# EAGLE schematic ArtNet_Node (EAGLE 6.5.0)
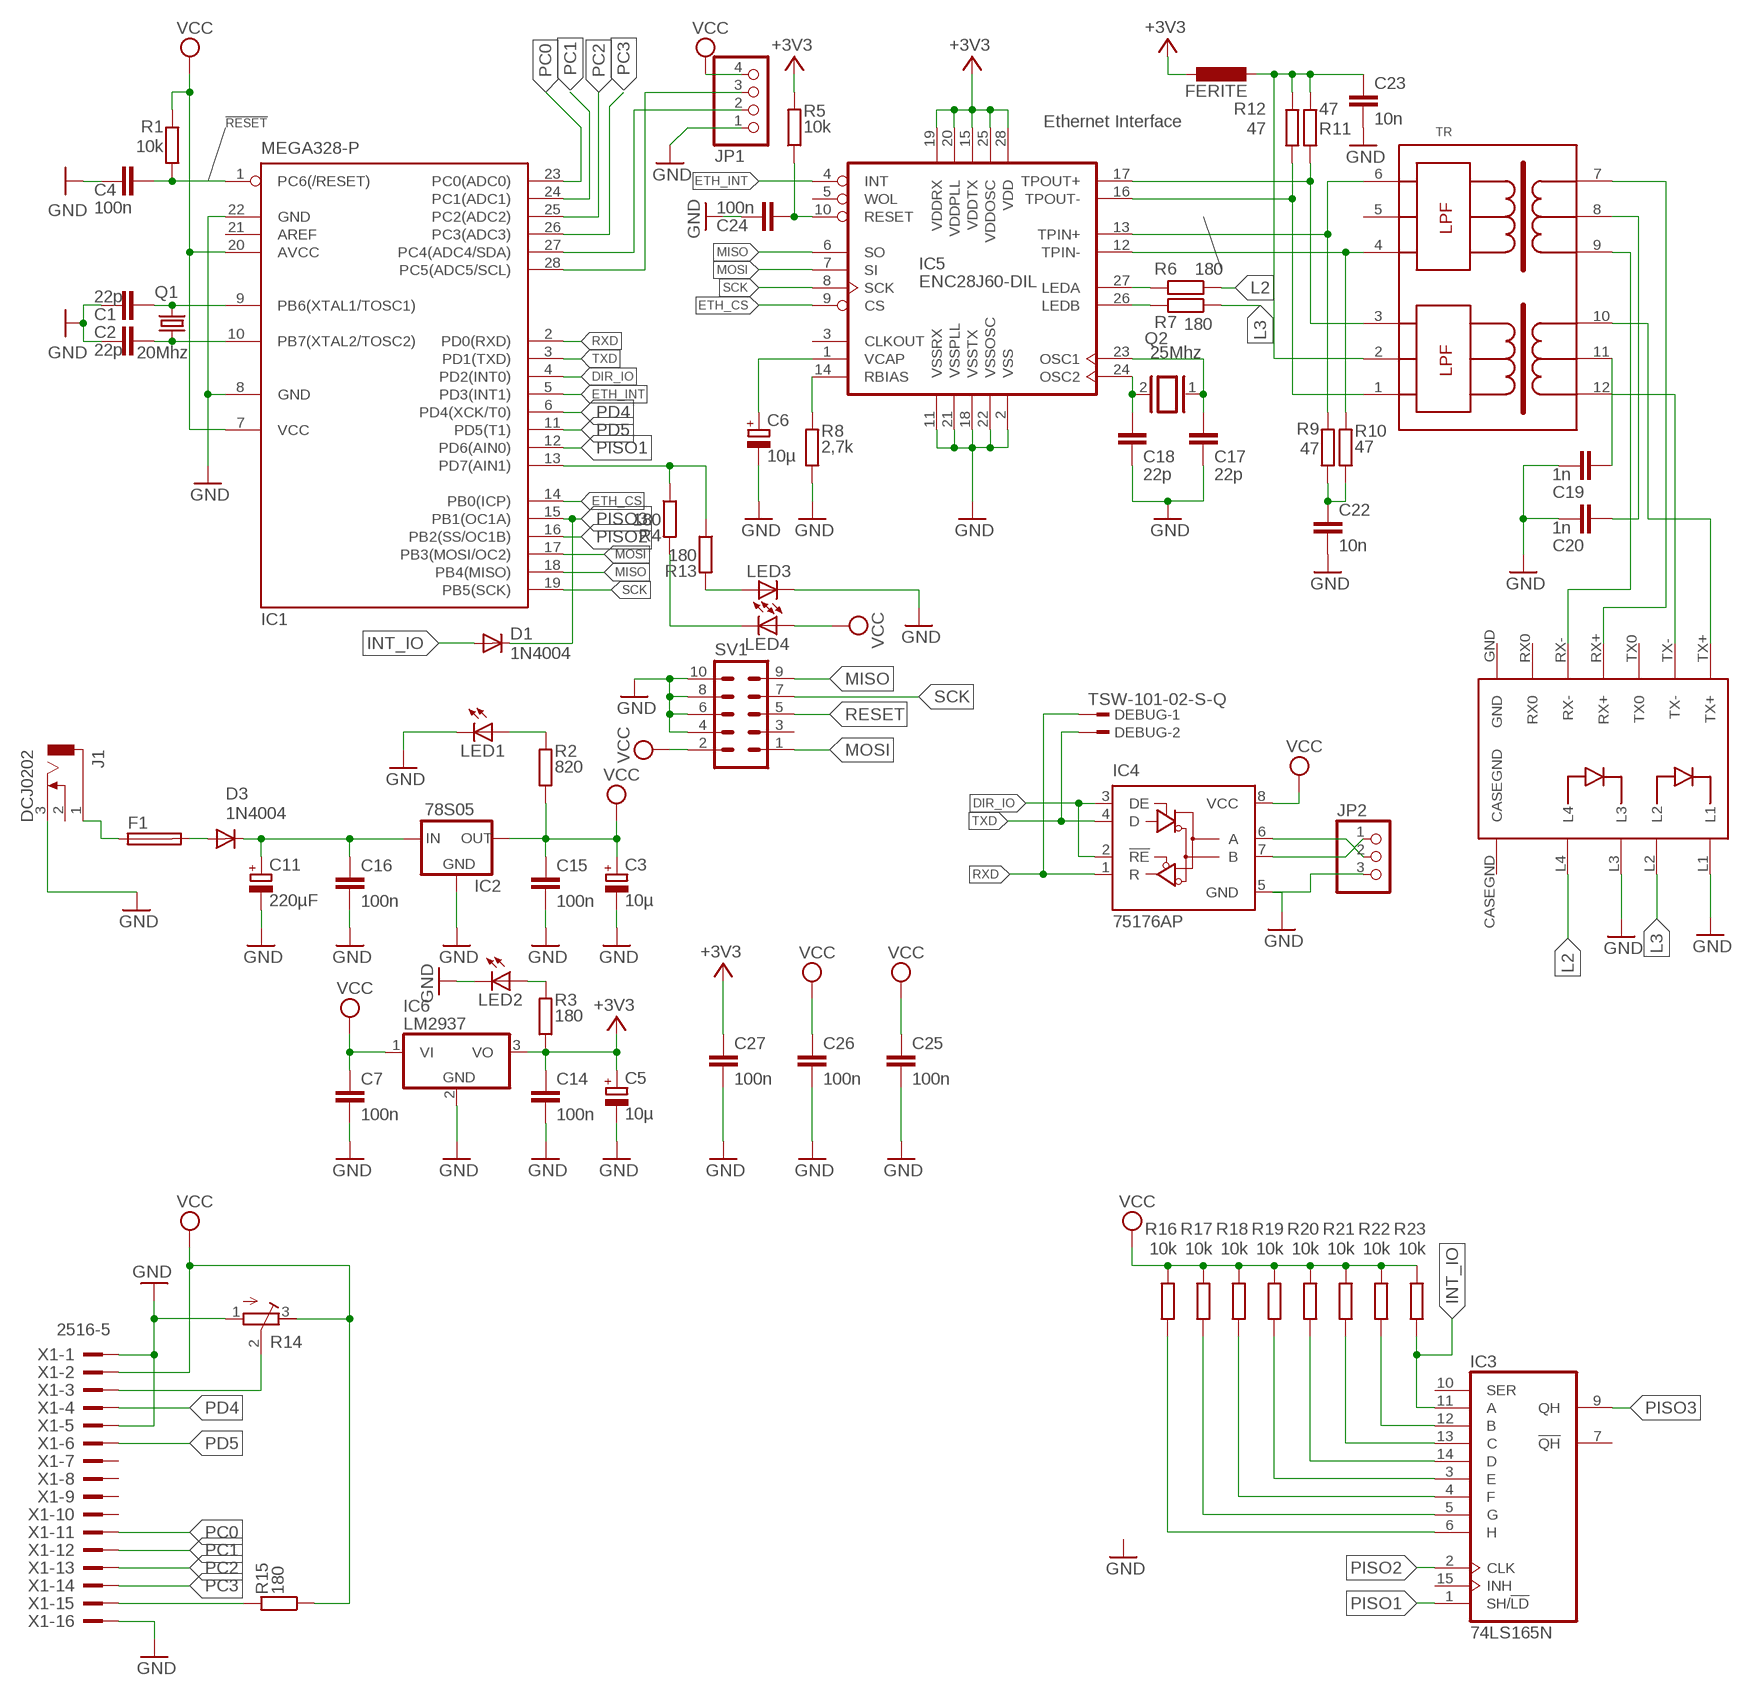
[diagram p0: schematic, sheet 1]

## Parts
C1  22p  C-EU025-024X044  [C025-024X044]
C2  22p  C-EU025-024X044  [C025-024X044]
C3  10µ  CPOL-EUE2-5  [E2-5]
C4  100n  C-EU025-024X044  [C025-024X044]
C5  10µ  CPOL-EUE2-5  [E2-5]
C6  10µ  CPOL-EUE2-5  [E2-5]
C7  100n  C-EU025-024X044  [C025-024X044]
C11  220µF  CPOL-EUE3.5-8  [E3,5-8]
C14  100n  C-EU025-024X044  [C025-024X044]
C15  100n  C-EU050-024X044  [C050-024X044]
C16  100n  C-EU050-024X044  [C050-024X044]
C17  22p  C-EU025-024X044  [C025-024X044]
C18  22p  C-EU025-024X044  [C025-024X044]
C19  1n  C-EU025-024X044  [C025-024X044]
C20  1n  C-EU025-024X044  [C025-024X044]
C22  10n  C-EU025-025X050  [C025-025X050]
C23  10n  C-EU025-025X050  [C025-025X050]
C24  100n  C-EU025-024X044  [C025-024X044]
C25  100n  C-EU025-025X050  [C025-025X050]
C26  100n  C-EU025-025X050  [C025-025X050]
C27  100n  C-EU025-025X050  [C025-025X050]
D1  1N4004  [DO41-10]
D3  1N4004  [DO41-10]
DEBUG  TSW-101-02-S-Q  [TSW-101-02-S-Q]
F1  PICOFUSE  [PICOFUSE]
FERITE  L-EU0204/5  [0204/5]
IC1  MEGA328-P  MEGA8-P  [DIL28-3]
IC2  78S05  78XXL  [78XXL]
IC3  74LS165N  [DIL16]
IC4  75176AP  [DIL08]
IC5  ENC28J60-DIL  [DIL28-3]
IC6  LM2937  [TO263-3]
J1  DCJ0202  [DCJ0202]
JP1  PINHD-1X4  [1X04]
JP2  PINHD-1X3  [1X03]
LED1  LED5MM  [LED5MM]
LED2  LED5MM  [LED5MM]
LED3  LED5MM  [LED5MM]
LED4  LED5MM  [LED5MM]
Q1  20Mhz  CRYTALHC49U-V  [HC49U-V]
Q2  25Mhz  XTAL/S  [QS]
R1  10k  R-EU_0207/10  [0207/10]
R2  820  R-EU_0207/10  [0207/10]
R3  180  R-EU_0207/10  [0207/10]
R4  180  R-EU_0207/10  [0207/10]
R5  10k  R-EU_0207/10  [0207/10]
R6  180  R-EU_0207/10  [0207/10]
R7  180  R-EU_0207/10  [0207/10]
R8  2,7k  R-EU_0207/10  [0207/10]
R9  47  R-EU_0207/10  [0207/10]
R10  47  R-EU_0207/10  [0207/10]
R11  47  R-EU_0207/10  [0207/10]
R12  47  R-EU_0207/10  [0207/10]
R13  180  R-EU_0207/10  [0207/10]
R14  R-TRIMM74X  [RTRIM74X]
R15  180  R-EU_0207/10  [0207/10]
R16  10k  R-EU_0207/10  [0207/10]
R17  10k  R-EU_0207/10  [0207/10]
R18  10k  R-EU_0207/10  [0207/10]
R19  10k  R-EU_0207/10  [0207/10]
R20  10k  R-EU_0207/10  [0207/10]
R21  10k  R-EU_0207/10  [0207/10]
R22  10k  R-EU_0207/10  [0207/10]
R23  10k  R-EU_0207/10  [0207/10]
SV1  ML10L  [ML10L]
TR  20F001  [DIL16/12]
U$1  1XRJ45_MM_JACK  [1XRJ45_MM_JACK]
X1  2516-5  [PAK100/2500-5-16]

## Nets
!RESET: C4.2 IC1.1(PC6(/RESET)) R1.1
+3V3: C5.+ C14.1 C27.1 FERITE.1 IC5.15(VDDTX) IC5.19(VDDRX) IC5.20(VDDPLL) IC5.25(VDDOSC) IC5.28(VDD) IC6.3(VO) R3.1 R5.2
DIR_IO: IC1.4(PD2(INT0)) IC4.2(!RE) IC4.3(DE)
ETH_CS: IC1.14(PB0(ICP)) IC5.9(CS)
ETH_INT: IC1.5(PD3(INT1)) IC5.4(INT)
GND: C1.1 C2.1 C3.- C4.1 C5.- C6.- C7.2 C11.- C14.2 C15.2 C16.2 C17.1 C18.1 C19.2 C20.2 C22.2 C23.2 C24.1 C25.1 C26.2 C27.2 IC1.8(GND) IC1.22(GND) IC2.GND IC4.5(GND) IC5.2(VSS) IC5.11(VSSRX) IC5.18(VSSTX) IC5.21(VSSPLL) IC5.22(VSSOSC) IC6.2(GND) J1.3 JP1.1 JP2.3 LED1.K(C) LED2.K(C) LED3.K(C) R8.1 R14.1(E) SV1.4 SV1.6 SV1.8 SV1.10 U$1.L1 U$1.L3 X1.1 X1.5 X1.16
INT_IO: D1.A IC3.11(A) R23.2
L2: R6.1 U$1.L4
L3: R7.1 U$1.L2
MISO: IC1.18(PB4(MISO)) IC5.6(SO) SV1.9
MOSI: IC1.17(PB3(MOSI/OC2)) IC5.7(SI) SV1.1
N$1: C2.2 IC1.10(PB7(XTAL2/TOSC2)) Q1.1
N$2: C1.2 IC1.9(PB6(XTAL1/TOSC1)) Q1.2
N$3: TR.9 U$1.RX-
N$6: D3.A F1.2
N$7: TR.12 U$1.TX-
N$8: TR.10 U$1.TX+
N$9: IC4.7(B) JP2.1
N$10: F1.1 J1.1
N$11: IC5.27(LEDA) R6.2
N$12: IC1.27(PC4(ADC4/SDA)) JP1.2
N$13: IC4.6(A) JP2.2
N$14: IC5.26(LEDB) R7.2
N$15: TR.7 U$1.RX+
N$16: C20.1 TR.8
N$17: C19.1 TR.11
N$20: C18.2 IC5.24(OSC2) Q2.2
N$21: C17.2 IC5.23(OSC1) Q2.1
N$22: IC5.12(TPIN-) R10.2 TR.4
N$23: IC5.13(TPIN+) R9.2 TR.6
N$24: IC5.16(TPOUT-) R12.2 TR.1
N$25: IC5.17(TPOUT+) R11.2 TR.3
N$26: IC5.14(RBIAS) R8.2
N$27: C6.+ IC5.1(VCAP)
N$28: IC1.28(PC5(ADC5/SCL)) JP1.3
N$29: C22.1 R9.1 R10.1
N$30: C24.2 IC5.10(RESET) R5.1
N$31: LED1.A R2.2
N$32: LED2.A R3.2
N$33: IC1.13(PD7(AIN1)) R4.1 R13.1
N$34: R14.2(S) X1.3
N$35: LED3.A R13.2
N$36: LED4.K(C) R4.2
N$38: R15.2 X1.15
N$39: IC3.12(B) R22.2
N$40: IC3.13(C) R21.2
N$41: IC3.14(D) R20.2
N$42: IC3.3(E) R19.2
N$43: IC3.4(F) R18.2
N$44: IC3.5(G) R17.2
N$45: IC3.6(H) R16.2
N$46: LED4.A ; supply symbol labelled VCC
N$248: C23.1 FERITE.2 R11.1 R12.1 TR.2
N$250: C11.+ C16.1 D3.C IC2.IN
PC0: IC1.23(PC0(ADC0)) X1.11
PC1: IC1.24(PC1(ADC1)) X1.12
PC2: IC1.25(PC2(ADC2)) X1.13
PC3: IC1.26(PC3(ADC3)) X1.14
PD4: IC1.6(PD4(XCK/T0)) X1.4
PD5: IC1.11(PD5(T1)) X1.6
PISO1: IC1.12(PD6(AIN0)) IC3.1(SH/!LD)
PISO2: IC1.16(PB2(SS/OC1B)) IC3.2(CLK)
PISO3: D1.C IC1.15(PB1(OC1A)) IC3.9(QH)
RESET: SV1.5
RXD: DEBUG.1 IC1.2(PD0(RXD)) IC4.1(R)
SCK: IC1.19(PB5(SCK)) IC5.8(SCK) SV1.7
TXD: DEBUG.2 IC1.3(PD1(TXD)) IC4.4(D)
VCC: C3.+ C7.1 C15.1 C25.2 C26.1 IC1.7(VCC) IC1.20(AVCC) IC2.OUT IC4.8(VCC) IC6.1(VI) JP1.4 R1.2 R2.1 R14.3(A) R15.1 R16.1 R17.1 R18.1 R19.1 R20.1 R21.1 R22.1 R23.1 SV1.2 X1.2
Unconnected: IC1.21(AREF) IC3.7(!QH) IC3.10(SER) IC3.15(INH) IC5.3(CLKOUT) IC5.5(WOL) J1.2 SV1.3 TR.5 U$1.CASEGND U$1.GND U$1.RX0 U$1.TX0 X1.7 X1.8 X1.9 X1.10

## Notes on the sheet
- Ethernet Interface

## Power pins joined to a net without a drawn wire
GND: IC3.8(GND)
VCC: IC3.16(VCC)

## Library data of the parts
C1 C2 C4 C7 C14-C20 C22-C27 = rcl:C-EU: CAPACITOR, European symbol
C3 C5 C6 C11 = rcl:CPOL-EU: POLARIZED CAPACITOR, European symbol
D1 D3 = diode:1N4004: DIODE general purpose rectifier, 1 A
DEBUG = con-samtec:TSW-101-02-S-Q: THROUGH-HOLE .025" SQ POST HEADER Source: Samtec TSW.pdf; OC_FARNELL: unknown; OC_NEWARK: unknown
F1 = fuse:PICOFUSE: PICOFUSE 19275, Wickmann
FERITE = rcl:L-EU: INDUCTOR, European symbol
IC1 = atmel:MEGA8-P: MICROCONTROLLER 8 Kbytes FLASH, 1 kbytes SRAM, 512 bytes EEPROM, USART, 4-channel 10 bit ADC, 2-channel 8 bit ADC Pin compatible with Atmega48, ATMega88, ATMega168 Source: avr.lbr; OC_FARNELL: unknown; OC_NEWARK: unknown
IC2 = v-reg:78XXL: VOLTAGE REGULATOR
IC3 = 74xx-us:74*165: 8-bit parallel load SHIFT REGISTER
IC4 = 751xx:75176A: DIFFERENTIAL BUS TRANSCEIVER Source: http://focus.ti.com/lit/ds/symlink/sn75176a.pdf
IC5 = enc28j60centered:ENC28J60-*: Microchip 10Mbit Ethernet controller with SPI interface Improved SOIC28 layout (pads in 0.01 raster, pin1 slightly smaller). Pin 6 (SO) changed from Out (paralleling several Outs gives an error) to OC. Author: Profi from mikrocontroller.net - forum Date: 2006.0827
IC6 = linear:LM2937: LM2937-2.5, LM2937-3.3 400mA and 500mA Voltage Regulators Source: http://cache.national.com/ds/LM/LM2937-2.5.pdf
J1 = con-jack:DCJ0202: DC POWER JACK Source: DCJ0202.pdf; OC_FARNELL: unknown; OC_NEWARK: unknown
JP1 = pinhead:PINHD-1X4: PIN HEADER
JP2 = pinhead:PINHD-1X3: PIN HEADER
LED1-LED4 = led:LED: LED OSRAM: - CHIPLED LG R971, LG N971, LY N971, LG Q971, LY Q971, LO R971, LY R971 LH N974, LH R974 LS Q976, LO Q976, LY Q976 LO Q996 - Hyper CHIPLED LW Q18S LB Q993, LB Q99A, LB R99A - SideLED LS A670, LO A670, LY A670, LG A670, LP A670 LB A673, LV A673, LT A673, LW A673 LH A674 LY A675 LS A676, LA A676, LO A676, LY A676, LW A676 LS A679, LY A679, LG A679 - Hyper Micro SIDELED® LS Y876, LA Y876, LO Y876, LY Y876 LT Y87S - SmartLED LW L88C, LW L88S LB L89C, LB L89S, LG L890 LS L89K, LO L89K, LY L89K LS L896, LA L896, LO L896, LY L896 - TOPLED LS T670, LO T670, LY T670, LG T670, LP T670 LSG T670, LSP T670, LSY T670, LOP T670, LYG T670 LG T671, LOG T671, LSG T671 LB T673, LV T673, LT T673, LW T673 LH T674 LS T676, LA T676, LO T676, LY T676, LB T676, LH T676, LSB T676, LW T676 LB T67C, LV T67C, LT T67C, LS T67K, LO T67K, LY T67K, LW E67C LS E67B, LA E67B, LO E67B, LY E67B, LB E67C, LV E67C, LT E67C LW T67C LS T679, LY T679, LG T679 LS T770, LO T770, LY T770, LG T770, LP T770 LB T773, LV T773, LT T773, LW T773 LH T774 LS E675, LA E675, LY E675, LS T675 LS T776, LA T776, LO T776, LY T776, LB T776 LHGB T686 LT T68C, LB T68C - Hyper Mini TOPLED® LB M676 - Mini TOPLED Santana® LG M470 LS M47K, LO M47K, LY M47K Source: http://www.osram.convergy.de LUXEON: - LUMILED® LXK2-PW12-R00, LXK2-PW12-S00, LXK2-PW14-U00, LXK2-PW14-V00 LXK2-PM12-R00, LXK2-PM12-S00, LXK2-PM14-U00 LXK2-PE12-Q00, LXK2-PE12-R00, LXK2-PE12-S00, LXK2-PE14-T00, LXK2-PE14-U00 LXK2-PB12-K00, LXK2-PB12-L00, LXK2-PB12-M00, LXK2-PB14-N00, LXK2-PB14-P00, LXK2-PB14-Q00 LXK2-PR12-L00, LXK2-PR12-M00, LXK2-PR14-Q00, LXK2-PR14-R00 LXK2-PD12-Q00, LXK2-PD12-R00, LXK2-PD12-S00 LXK2-PH12-R00, LXK2-PH12-S00 LXK2-PL12-P00, LXK2-PL12-Q00, LXK2-PL12-R00 Source: www.luxeon.com KINGBRIGHT: KA-3528ASYC Source: www.kingbright.com
Q1 = crystal:CRYTAL: CRYSTAL
Q2 = special:XTAL/S: CRYSTAL
R1-R13 R15-R23 = rcl:R-EU_: RESISTOR, European symbol
R14 = resistor:R-TRIMM: Trimm resistor
SV1 = con-harting-ml:ML10: HARTING; OC_FARNELL: unknown; OC_NEWARK: unknown
TR = Realtek:20F001
U$1 = con-ppt_prj006:1XRJ45_MM_JACK: PPT PRJ-006
X1 = con-3m:2516-: 3M (TM) Pak 100 4-Wall Header Source: 3M; MPN: D2516-5002-AR; OC_FARNELL: 9838376; OC_NEWARK: 12P7055

## Net classes
0 default: clearance 0.205 mm